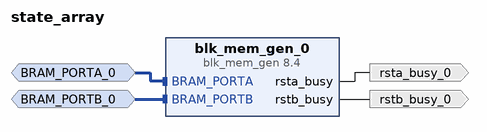
[diagram p0: block diagram of the top level]
# Vivado block design state_array, xc7vx485tffg1761-2, Vivado 2019.1
create_bd_design state_array

create_bd_intf_port -mode Slave -vlnv xilinx.com:interface:bram_rtl:1.0 BRAM_PORTA_0
create_bd_intf_port -mode Slave -vlnv xilinx.com:interface:bram_rtl:1.0 BRAM_PORTB_0
create_bd_port -dir O rsta_busy_0
create_bd_port -dir O rstb_busy_0

create_bd_cell -type ip -vlnv xilinx.com:ip:blk_mem_gen:8.4 blk_mem_gen_0
set_property -dict [list \
  CONFIG.Assume_Synchronous_Clk true \
  CONFIG.EN_SAFETY_CKT true \
  CONFIG.Enable_32bit_Address false \
  CONFIG.Enable_B Use_ENB_Pin \
  CONFIG.Memory_Type True_Dual_Port_RAM \
  CONFIG.Port_B_Clock 100 \
  CONFIG.Port_B_Enable_Rate 100 \
  CONFIG.Port_B_Write_Rate 50 \
  CONFIG.Read_Width_A 64 \
  CONFIG.Read_Width_B 64 \
  CONFIG.Register_PortA_Output_of_Memory_Primitives true \
  CONFIG.Register_PortB_Output_of_Memory_Primitives true \
  CONFIG.Use_Byte_Write_Enable false \
  CONFIG.Use_RSTA_Pin true \
  CONFIG.Use_RSTB_Pin true \
  CONFIG.Write_Depth_A 25 \
  CONFIG.Write_Width_A 64 \
  CONFIG.Write_Width_B 64 \
  CONFIG.use_bram_block Stand_Alone \
] [get_bd_cells blk_mem_gen_0]

# ---- connections ----

connect_bd_intf_net -intf_net BRAM_PORTA_0_1 [get_bd_intf_ports BRAM_PORTA_0] [get_bd_intf_pins blk_mem_gen_0/BRAM_PORTA]
connect_bd_intf_net -intf_net BRAM_PORTB_0_1 [get_bd_intf_ports BRAM_PORTB_0] [get_bd_intf_pins blk_mem_gen_0/BRAM_PORTB]
connect_bd_net [get_bd_pins blk_mem_gen_0/rsta_busy] [get_bd_ports rsta_busy_0]
connect_bd_net [get_bd_pins blk_mem_gen_0/rstb_busy] [get_bd_ports rstb_busy_0]

validate_bd_design
save_bd_design
